# Altium project 4GLuxLogger.PrjPcb
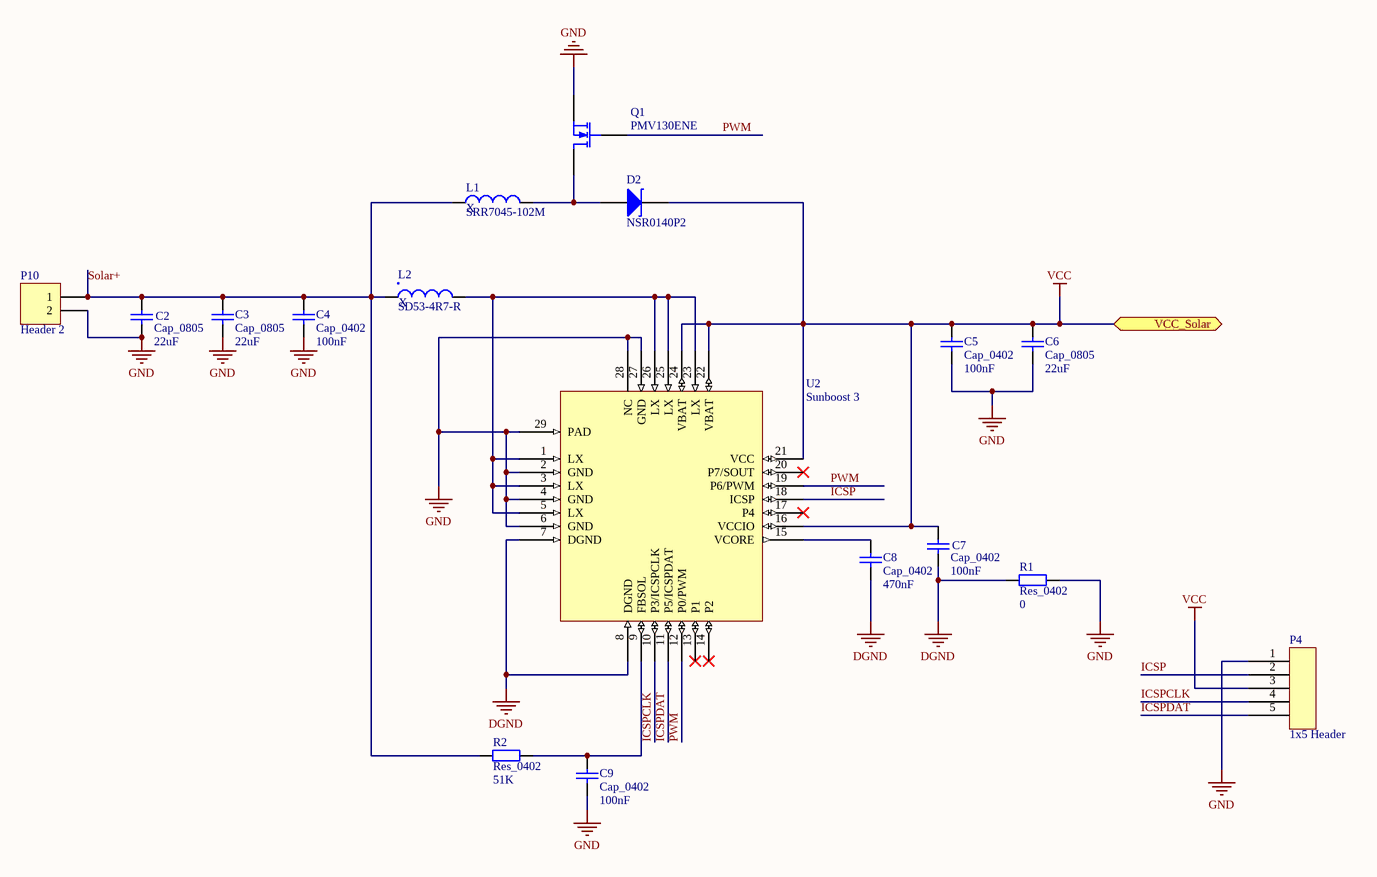
[diagram p0: SunBoost.SchDoc]
Project: 4GLX; Version: 1.0
4 sheets, 111 parts. Net scope: flat (ports and power ports of the same name join across sheets).
Board files: 6C-4L-1550um.PcbDoc, 4GLL_V2.PcbDoc
Sheets:
  SunBoost.SchDoc
  4G.SchDoc
  Power.SchDoc
  Mesh.SchDoc

## Sheet SunBoost.SchDoc
size A3; Organization: Altium Limited; Address1: L3, 12a Rodborough Rd; Address2: Frenchs Forest; Address3: NSW; Address4: Australia 2086

### Parts
C2  Cap_0805  value 22uF  [0805]
C3  Cap_0805  value 22uF  [0805]
C4  Cap_0402  value 100nF  [0402]
C5  Cap_0402  value 100nF  [0402]
C6  Cap_0805  value 22uF  [0805]
C7  Cap_0402  value 100nF  [0402]
C8  Cap_0402  value 470nF  [0402]
C9  Cap_0402  value 100nF  [0402]
D2  NSR0140P2  [SOD-923]
L1  SRR7045-102M  value X  [SRR7045-102M]
L2  SD53-4R7-R  value X  [SD53-4R7-R]
P4  1x5 Header  [1x5 Header 1.27]
P10  Header 2  [HDR1X2]
Q1  PMV130ENE  [SOT-23]
R1  Res_0402  value 0  [0402]
R2  Res_0402  value 51K  [0402]
U2  Sunboost 3  [28-QFN_0.4mm]

### Ports
VCC_Solar (bidir)

### Nets
DGND: C7.1 C8.1 R1.1 U2.7(DGND) U2.8(DGND)
GND: C2.1 C3.1 C4.1 C5.1 C6.1 C9.1 P4.1 P10.2 Q1.2(S) R1.2 U2.2(GND) U2.4(GND) U2.6(GND) U2.27(GND) U2.28(NC) U2.29(PAD)
VCC: C5.2 C6.2 C7.2 D2.1(K) P4.3 U2.16(VCCIO) U2.21(VCC) U2.22(VBAT) U2.24(VBAT) ; port VCC_Solar
ICSP: P4.2 U2.18(ICSP)
ICSPCLK: P4.4 U2.10(P3/ICSPCLK)
ICSPDAT: P4.5 U2.11(P5/ICSPDAT)
PWM: Q1.1(G) U2.12(P0/PWM) U2.19(P6/PWM)
Solar+: C2.2 C3.2 C4.2 L1.1 L2.1 P10.1 R2.1
NetC8_2: C8.2 U2.15(VCORE)
NetC9_2: C9.2 R2.2 U2.9(FBSOL)
NetD2_2: D2.2(A) L1.2 Q1.3(D)
NetL2_2: L2.2 U2.1(LX) U2.3(LX) U2.5(LX) U2.23(LX) U2.25(LX) U2.26(LX)

Not connected (* = marked no-connect by the designer): U2 13(P1)* 14(P2)* 17(P4)* 20(P7/SOUT)*

### Notes on the sheet
- Title
- Size:
- Date:
- A3
- Number:
- Time:
- Revision:
- Sheet
- of
- File:

### Library data of the parts
C2 C3 C6 = Cap_0805: Capacitor; Published: 8-Jun-2000; LatestRevisionDate: 17-Jul-2002; LatestRevisionNote: Re-released for DXP Platform.; PackageReference: RAD-0.3; Publisher: Altium Limited; PackageDescription: Radial Cap, Thru-Hole; 2 Leads; 0.3 in Pin Spacing
C4 C5 C7-C9 = Cap_0402: Capacitor; Published: 8-Jun-2000; LatestRevisionDate: 17-Jul-2002; LatestRevisionNote: Re-released for DXP Platform.; PackageReference: RAD-0.3; Publisher: Altium Limited; PackageDescription: Radial Cap, Thru-Hole; 2 Leads; 0.3 in Pin Spacing
D2 = NSR0140P2: Typical INFRARED GaAs LED; Published: 8-Jun-2000; LatestRevisionDate: 08-Jul-2005; LatestRevisionNote: Mech Layer 1 removed.; PackageReference: LED-0; Publisher: Altium Limited; PackageDescription: LED; 2 Leads
L1 = SRR7045-102M: Inductor
L2 = SD53-4R7-R: Inductor
P10 = Header 2: Header, 2-Pin; LatestRevisionDate: 17-Jul-2002; LatestRevisionNote: Re-released for DXP Platform.; Publisher: Altium Limited
Q1 = PMV130ENE: N-Channel MOSFET; Published: 8-Jun-2000; LatestRevisionDate: 17-Jul-2002; LatestRevisionNote: Re-released for DXP Platform.; PackageVersion: 1995/1996; PackageReference: E3; Publisher: Altium Limited; PackageDescription: TO, Flat Index; 3 In-Line, Axial Leads; Body Dia. 4.6mm; Lead Dia. 0.5 mm (max)
R1 R2 = Res_0402: Resistor; Published: 8-Jun-2000; LatestRevisionDate: 17-Jul-2002; LatestRevisionNote: Re-released for DXP Platform.; PackageReference: AXIAL-0.4; Publisher: Altium Limited; PackageDescription: Axial Device, Thru-Hole; 2 Leads; 0.4 in Pin Spacing
U2 = Sunboost 3: Initvation Sunboost 3

## Sheet 4G.SchDoc
size A3; Organization: Altium Limited; Address1: L3, 12a Rodborough Rd; Address2: Frenchs Forest; Address3: NSW; Address4: Australia 2086
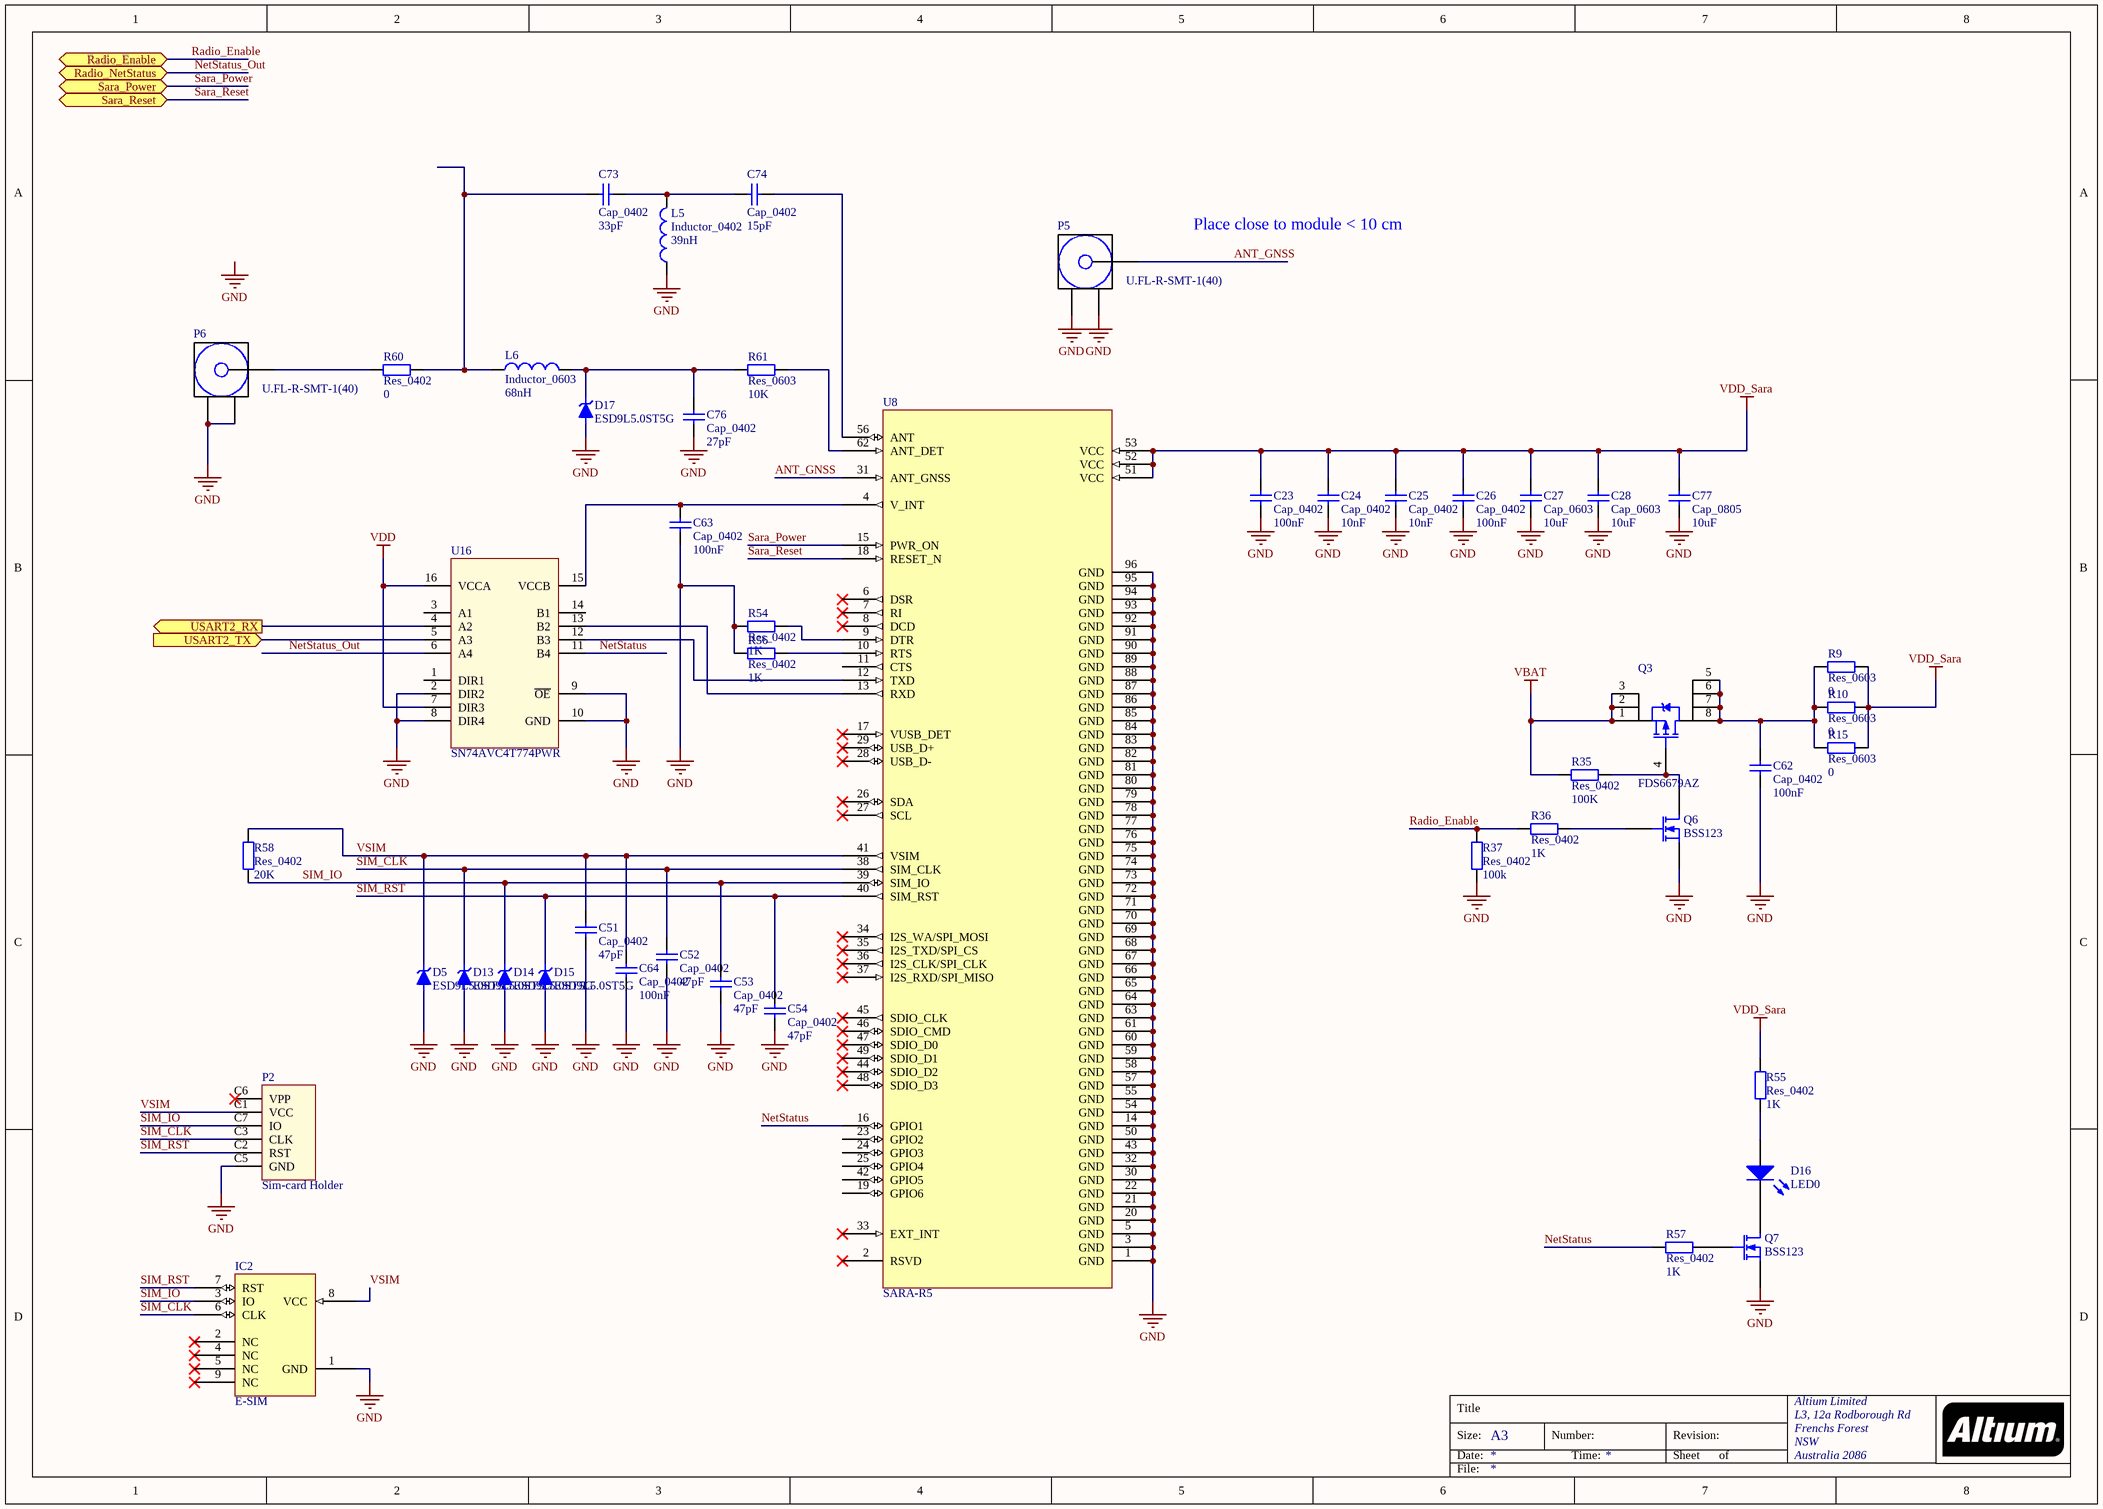
[diagram p1: 4G.SchDoc]

### Parts
C23  Cap_0402  value 100nF  [0402]
C24  Cap_0402  value 10nF  [0402]
C25  Cap_0402  value 10nF  [0402]
C26  Cap_0402  value 100nF  [0402]
C27  Cap_0603  value 10uF  [0603]
C28  Cap_0603  value 10uF  [0603]
C51  Cap_0402  value 47pF  [0402]
C52  Cap_0402  value 47pF  [0402]
C53  Cap_0402  value 47pF  [0402]
C54  Cap_0402  value 47pF  [0402]
C62  Cap_0402  value 100nF  [0402]
C63  Cap_0402  value 100nF  [0402]
C64  Cap_0402  value 100nF  [0402]
C73  Cap_0402  value 33pF  [0402]
C74  Cap_0402  value 15pF  [0402]
C76  Cap_0402  value 27pF  [0402]
C77  Cap_0805  value 10uF  [0805]
D5  ESD9L5.0ST5G  [SODFL100X40-2N]
D13  ESD9L5.0ST5G  [SODFL100X40-2N]
D14  ESD9L5.0ST5G  [SODFL100X40-2N]
D15  ESD9L5.0ST5G  [SODFL100X40-2N]
D16  LED0  [0603]
D17  ESD9L5.0ST5G  [SODFL100X40-2N]
IC2  E-SIM  [MFF2-ESIM]
L5  Inductor_0402  value 39nH  [0402]
L6  Inductor_0603  value 68nH  [0603]
P2  Sim-card Holder  [Sim-card Holder]
P5  U.FL-R-SMT-1(40)  [U.FL-R-SMT-1(40)]
P6  U.FL-R-SMT-1(40)  [U.FL-R-SMT-1(40)]
Q3  FDS6679AZ  [SOIC127P600X175-8N]
Q6  BSS123  [SOT-23]
Q7  BSS123  [SOT-23]
R9  Res_0603  value 0  [0603]
R10  Res_0603  value 0  [0603]
R15  Res_0603  value 0  [0603]
R35  Res_0402  value 100K  [0402]
R36  Res_0402  value 1K  [0402]
R37  Res_0402  value 100k  [0402]
R54  Res_0402  value 1K  [0402]
R55  Res_0402  value 1K  [0402]
R56  Res_0402  value 1K  [0402]
R57  Res_0402  value 1K  [0402]
R58  Res_0402  value 20K  [0402]
R60  Res_0402  value 0  [0402]
R61  Res_0603  value 10K  [0603]
U8  SARA-R5  [SARA-XX]
U16  SN74AVC4T774PWR  [TSOP65P640X120-16N]

### Ports
Radio_Enable (bidir), Radio_NetStatus (bidir), Sara_Power (bidir), Sara_Reset (bidir), USART2_RX (out), USART2_TX (in)

### Nets
GND: C23.1 C24.1 C25.1 C26.1 C27.1 C28.1 C51.1 C52.1 C53.1 C54.1 C62.1 C63.1 C64.1 C76.1 C77.1 D5.2 D13.2 D14.2 D15.2 D17.2 IC2.1(GND) L5.1 P2.C5(GND) P5.2 P5.3 P6.2 P6.3 Q6.2(S) Q7.2(S) R37.1 R54.1 R56.1 U8.1(GND) U8.3(GND) U8.5(GND) U8.14(GND) U8.20(GND) U8.21(GND) U8.22(GND) U8.30(GND) U8.32(GND) U8.43(GND) U8.50(GND) U8.54(GND) U8.55(GND) U8.57(GND) U8.58(GND) U8.59(GND) U8.60(GND) U8.61(GND) U8.63(GND) U8.64(GND) U8.65(GND) U8.66(GND) U8.67(GND) U8.68(GND) U8.69(GND) U8.70(GND) U8.71(GND) U8.72(GND) U8.73(GND) U8.74(GND) U8.75(GND) U8.76(GND) U8.77(GND) U8.78(GND) U8.79(GND) U8.80(GND) U8.81(GND) U8.82(GND) U8.83(GND) U8.84(GND) U8.85(GND) U8.86(GND) U8.87(GND) U8.88(GND) U8.89(GND) U8.90(GND) U8.91(GND) U8.92(GND) U8.93(GND) U8.94(GND) U8.95(GND) U8.96(GND) U16.2(DIR2) U16.8(DIR4) U16.9(~{OE}) U16.10(GND)
VBAT: Q3.1(S) Q3.2(S) Q3.3(S) R35.1
VDD: U16.7(DIR3) U16.16(VCCA)
VDD_Sara: C23.2 C24.2 C25.2 C26.2 C27.2 C28.2 C77.2 R9.2 R10.2 R15.2 R55.2 U8.51(VCC) U8.52(VCC) U8.53(VCC)
ANT_GNSS: P5.1 U8.31(ANT_GNSS)
NetStatus: R57.1 U8.16(GPIO1) U16.11(B4)
NetStatus_Out: U16.6(A4) ; port Radio_NetStatus
Radio_Enable: R36.1 R37.2 ; port Radio_Enable
Sara_Power: U8.15(PWR_ON) ; port Sara_Power
Sara_Reset: U8.18(RESET_N) ; port Sara_Reset
SIM_CLK: C52.2 D13.1 IC2.6(CLK) P2.C3(CLK) U8.38(SIM_CLK)
SIM_IO: C53.2 D14.1 IC2.3(IO) P2.C7(IO) R58.1 U8.39(SIM_IO)
SIM_RST: C54.2 D15.1 IC2.7(RST) P2.C2(RST) U8.40(SIM_RST)
VSIM: C51.2 C64.2 D5.1 IC2.8(VCC) P2.C1(VCC) R58.2 U8.41(VSIM)
NetC62_2: C62.2 Q3.5(D) Q3.6(D) Q3.7(D) Q3.8(D) R9.1 R10.1 R15.1
NetC63_2: C63.2 U8.4(V_INT) U16.15(VCCB)
NetC73_1: C73.1 C74.1 L5.2
NetC73_2: C73.2 L6.1 R60.2
NetC74_2: C74.2 U8.56(ANT)
NetC76_2: C76.2 D17.1 L6.2 R61.1
NetD16_1: D16.1(K) Q7.3(D)
NetD16_2: D16.2(A) R55.1
NetP6_1: P6.1 R60.1
NetQ3_4: Q3.4(G) Q6.3(D) R35.2
NetQ6_1: Q6.1(G) R36.2
NetQ7_1: Q7.1(G) R57.2
NetR54_2: R54.2 U8.9(DTR)
NetR56_2: R56.2 U8.10(RTS)
NetR61_2: R61.2 U8.62(ANT_DET)
NetU8_12: U8.12(TXD) U16.12(B3)
NetU8_13: U8.13(RXD) U16.13(B2)
NetU16_4: U16.4(A2) ; port USART2_RX
NetU16_5: U16.5(A3) ; port USART2_TX

Not connected (* = marked no-connect by the designer): IC2 2(NC)* 4(NC)* 5(NC)* 9(NC)*; P2 C6(VPP)*; U8 2(RSVD)* 6(DSR)* 7(RI)* 8(DCD)* 11(CTS) 17(VUSB_DET)* 19(GPIO6) 23(GPIO2) 24(GPIO3) 25(GPIO4) 26(SDA)* 27(SCL)* 28(USB_D-)* 29(USB_D+)* 33(EXT_INT)* 34(I2S_WA/SPI_MOSI)* 35(I2S_TXD/SPI_CS)* 36(I2S_CLK/SPI_CLK)* 37(I2S_RXD/SPI_MISO)* 42(GPIO5) 44(SDIO_D2)* 45(SDIO_CLK)* 46(SDIO_CMD)* 47(SDIO_D0)* 48(SDIO_D3)* 49(SDIO_D1)*; U16 1(DIR1) 3(A1) 14(B1)

### Notes on the sheet
- Place close to module < 10 cm
- Labels drawn without touching a wire or pin: GND
- Title
- Size:
- Date:
- A3
- Number:
- Time:
- Revision:
- Sheet
- of
- File:

### Library data of the parts
C23-C26 C51-C54 C62-C64 C73 C74 C76 = Cap_0402: Capacitor; Published: 8-Jun-2000; LatestRevisionDate: 17-Jul-2002; LatestRevisionNote: Re-released for DXP Platform.; PackageReference: RAD-0.3; Publisher: Altium Limited; PackageDescription: Radial Cap, Thru-Hole; 2 Leads; 0.3 in Pin Spacing
C27 C28 = Cap_0603: Capacitor; Published: 8-Jun-2000; LatestRevisionDate: 17-Jul-2002; LatestRevisionNote: Re-released for DXP Platform.; PackageReference: RAD-0.3; Publisher: Altium Limited; PackageDescription: Radial Cap, Thru-Hole; 2 Leads; 0.3 in Pin Spacing
C77 = Cap_0805: Capacitor; Published: 8-Jun-2000; LatestRevisionDate: 17-Jul-2002; LatestRevisionNote: Re-released for DXP Platform.; PackageReference: RAD-0.3; Publisher: Altium Limited; PackageDescription: Radial Cap, Thru-Hole; 2 Leads; 0.3 in Pin Spacing
D5 D13-D15 D17 = ESD9L5-0ST5G: TVS_ESD9L5-0ST5G
D16 = LED0: Typical INFRARED GaAs LED; Published: 8-Jun-2000; LatestRevisionDate: 08-Jul-2005; LatestRevisionNote: Mech Layer 1 removed.; PackageReference: LED-0; Publisher: Altium Limited; PackageDescription: LED; 2 Leads
L5 = Inductor_0402: Inductor
L6 = Inductor_0603: Inductor
P2 = Sim-card Holder: 788000001_Molex
P5 P6 = RF-Connector
Q3 = FDS6679AZ: Transistor, FET
Q6 Q7 = BSS123: N-Channel MOSFET; Published: 8-Jun-2000; LatestRevisionDate: 17-Jul-2002; LatestRevisionNote: Re-released for DXP Platform.; PackageVersion: 1995/1996; PackageReference: E3; Publisher: Altium Limited; PackageDescription: TO, Flat Index; 3 In-Line, Axial Leads; Body Dia. 4.6mm; Lead Dia. 0.5 mm (max)
R9 R10 R15 R61 = Res_0603: Resistor; Published: 8-Jun-2000; LatestRevisionDate: 17-Jul-2002; LatestRevisionNote: Re-released for DXP Platform.; PackageReference: AXIAL-0.4; Publisher: Altium Limited; PackageDescription: Axial Device, Thru-Hole; 2 Leads; 0.4 in Pin Spacing
R35-R37 R54-R58 R60 = Res_0402: Resistor; Published: 8-Jun-2000; LatestRevisionDate: 17-Jul-2002; LatestRevisionNote: Re-released for DXP Platform.; PackageReference: AXIAL-0.4; Publisher: Altium Limited; PackageDescription: Axial Device, Thru-Hole; 2 Leads; 0.4 in Pin Spacing
U16 = SN74AVC4T774PWR: Buffer

## Sheet Power.SchDoc
size A3; Organization: Altium Limited; Address1: L3, 12a Rodborough Rd; Address2: Frenchs Forest; Address3: NSW; Address4: Australia 2086
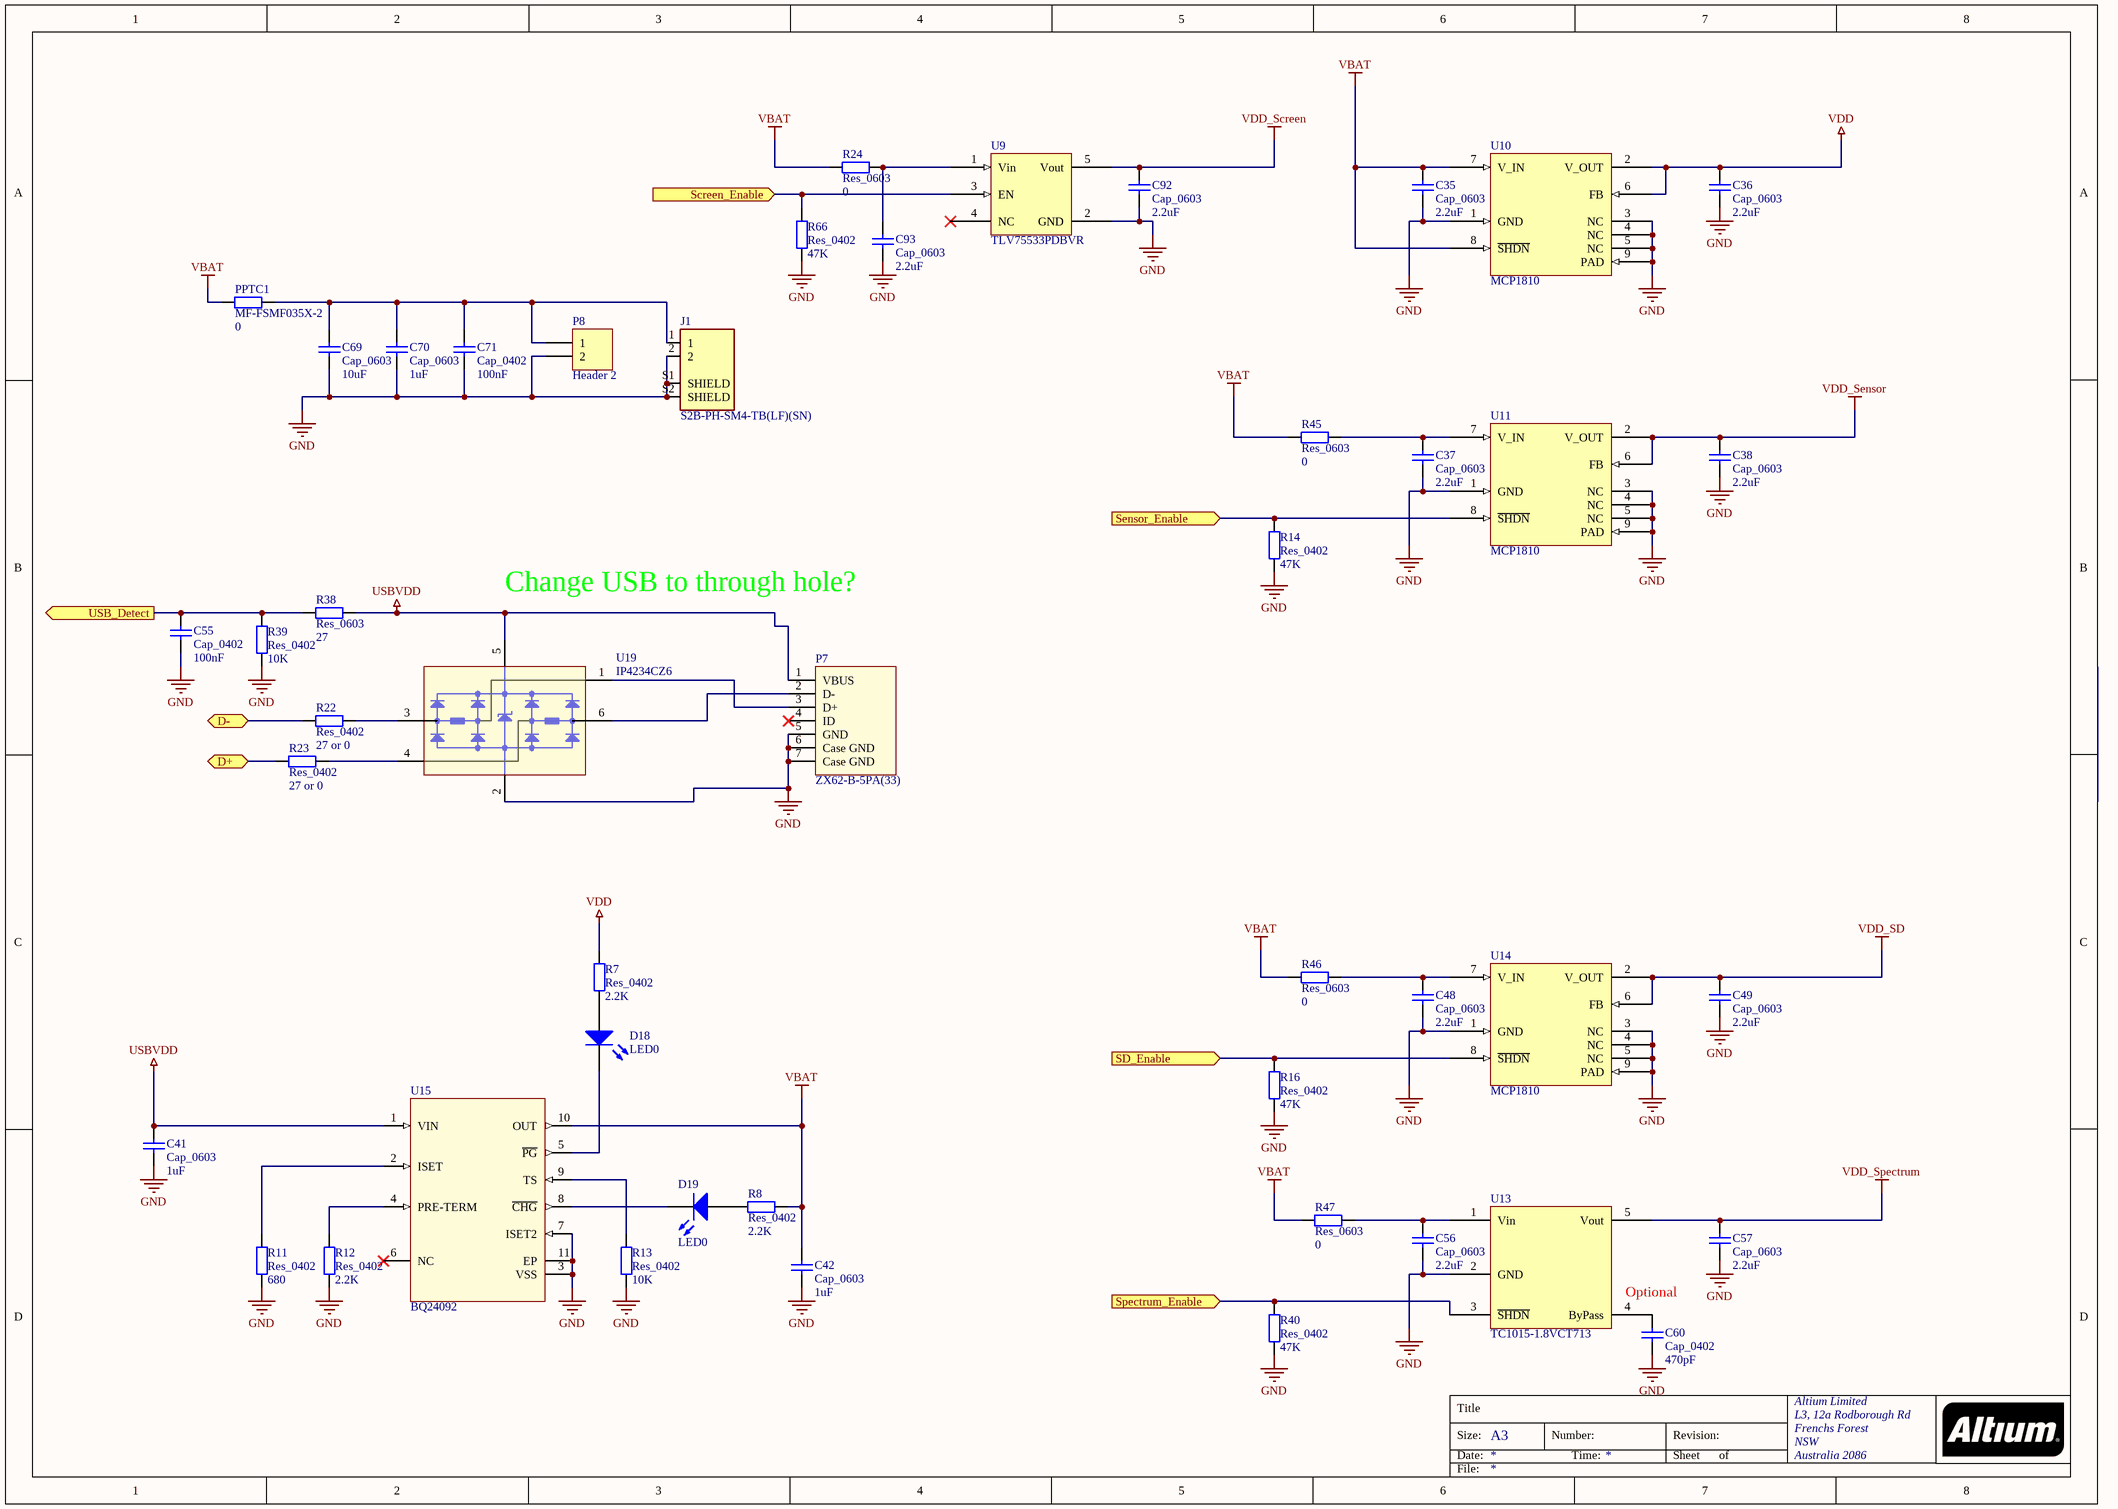
[diagram p2: Power.SchDoc]

### Parts
C35  Cap_0603  value 2.2uF  [0603]
C36  Cap_0603  value 2.2uF  [0603]
C37  Cap_0603  value 2.2uF  [0603]
C38  Cap_0603  value 2.2uF  [0603]
C41  Cap_0603  value 1uF  [0603]
C42  Cap_0603  value 1uF  [0603]
C48  Cap_0603  value 2.2uF  [0603]
C49  Cap_0603  value 2.2uF  [0603]
C55  Cap_0402  value 100nF  [0402]
C56  Cap_0603  value 2.2uF  [0603]
C57  Cap_0603  value 2.2uF  [0603]
C60  Cap_0402  value 470pF  [0402]
C69  Cap_0603  value 10uF  [0603]
C70  Cap_0603  value 1uF  [0603]
C71  Cap_0402  value 100nF  [0402]
C92  Cap_0603  value 2.2uF  [0603]
C93  Cap_0603  value 2.2uF  [0603]
D18  LED0  [0603]
D19  LED0  [0603]
J1  S2B-PH-SM4-TB(LF)(SN)  [JST_S2B-PH-SM4-TB(LF)(SN)]
P7  ZX62-B-5PA(33)  [ZX62-B-5PA(33)]
P8  Header 2  [HDR1X2]
PPTC1  MF-FSMF035X-2  value 0  [0603]
R7  Res_0402  value 2.2K  [0402]
R8  Res_0402  value 2.2K  [0402]
R11  Res_0402  value 680  [0402]
R12  Res_0402  value 2.2K  [0402]
R13  Res_0402  value 10K  [0402]
R14  Res_0402  value 47K  [0402]
R16  Res_0402  value 47K  [0402]
R22  Res_0402  value 27 or 0  [0402]
R23  Res_0402  value 27 or 0  [0402]
R24  Res_0603  value 0  [0603]
R38  Res_0603  value 27  [0603]
R39  Res_0402  value 10K  [0402]
R40  Res_0402  value 47K  [0402]
R45  Res_0603  value 0  [0603]
R46  Res_0603  value 0  [0603]
R47  Res_0603  value 0  [0603]
R66  Res_0402  value 47K  [0402]
U9  TLV75533PDBVR  [SOT-23 (5)]
U10  MCP1810  [VDFN8]
U11  MCP1810  [VDFN8]
U13  TC1015-1.8VCT713  [SOT-23 (5)]
U14  MCP1810  [VDFN8]
U15  BQ24092  [HVSSOP-10]
U19  IP4234CZ6  [TSOP95P280X110_HS-7N]

### Ports
D+ (bidir), D- (bidir), Screen_Enable (in), SD_Enable (in), Sensor_Enable (in), Spectrum_Enable (in), USB_Detect (out)

### Nets
GND: C35.1 C36.1 C37.1 C38.1 C41.1 C42.1 C48.1 C49.1 C55.1 C56.1 C57.1 C60.1 C69.1 C70.1 C71.1 C92.1 C93.1 J1.2 J1.S1(SHIELD) J1.S2(SHIELD) P7.5(GND) P7.6(Case_GND) P7.7(Case_GND) P8.2 R11.1 R12.1 R13.1 R14.2 R16.1 R39.1 R40.2 R66.2 U9.2(GND) U10.1(GND) U10.3(NC) U10.4(NC) U10.5(NC) U10.9(PAD) U11.1(GND) U11.3(NC) U11.4(NC) U11.5(NC) U11.9(PAD) U13.2(GND) U14.1(GND) U14.3(NC) U14.4(NC) U14.5(NC) U14.9(PAD) U15.3(VSS) U15.7(ISET2) U15.11(EP) U19.2(GND)
USBVDD: C41.2 P7.1(VBUS) R38.2 U15.1(VIN) U19.5(VCC)
VBAT: C35.2 C42.2 PPTC1.1 R8.1 R24.1 R45.1 R46.1 R47.1 U10.7(V_IN) U10.8(~{SHDN}) U15.10(OUT)
VDD: C36.2 R7.2 U10.2(V_OUT) U10.6(FB)
VDD_Screen: C92.2 U9.5(Vout)
VDD_SD: C49.2 U14.2(V_OUT) U14.6(FB)
VDD_Sensor: C38.2 U11.2(V_OUT) U11.6(FB)
VDD_Spectrum: C57.2 U13.5(Vout)
NetC37_2: C37.2 R45.2 U11.7(V_IN)
NetC48_2: C48.2 R46.2 U14.7(V_IN)
NetC55_2: C55.2 R38.1 R39.2 ; port USB_Detect
NetC56_2: C56.2 R47.2 U13.1(Vin)
NetC60_2: C60.2 U13.4(ByPass)
NetC69_2: C69.2 C70.2 C71.2 J1.1 P8.1 PPTC1.2
NetC93_2: C93.2 R24.2 U9.1(Vin)
NetD18_1: D18.1(K) U15.5(~{PG})
NetD18_2: D18.2(A) R7.1
NetD19_1: D19.1(K) U15.8(~{CHG})
NetD19_2: D19.2(A) R8.2
NetP7_2: P7.2(D-) U19.6(CH2_B)
NetP7_3: P7.3(D+) U19.1(CH1_A)
NetR11_2: R11.2 U15.2(ISET)
NetR12_2: R12.2 U15.4(PRE-TERM)
NetR13_2: R13.2 U15.9(TS)
NetR14_1: R14.1 U11.8(~{SHDN}) ; port Sensor_Enable
NetR16_2: R16.2 U14.8(~{SHDN}) ; port SD_Enable
NetR22_1: R22.1 ; port D-
NetR22_2: R22.2 U19.3(CH1_B)
NetR23_1: R23.1 ; port D+
NetR23_2: R23.2 U19.4(CH2_A)
NetR40_1: R40.1 U13.3(~{SHDN}) ; port Spectrum_Enable
NetR66_1: R66.1 U9.3(EN) ; port Screen_Enable

Not connected (* = marked no-connect by the designer): P7 4(ID)*; U9 4(NC)*; U15 6(NC)*

### Notes on the sheet
- Change USB to through hole?
- (near U13) Optional
- Title
- Size:
- Date:
- A3
- Number:
- Time:
- Revision:
- Sheet
- of
- File:

### Library data of the parts
C35-C38 C41 C42 C48 C49 C56 C57 C69 C70 C92 C93 = Cap_0603: Capacitor; Published: 8-Jun-2000; LatestRevisionDate: 17-Jul-2002; LatestRevisionNote: Re-released for DXP Platform.; PackageReference: RAD-0.3; Publisher: Altium Limited; PackageDescription: Radial Cap, Thru-Hole; 2 Leads; 0.3 in Pin Spacing
C55 C60 C71 = Cap_0402: Capacitor; Published: 8-Jun-2000; LatestRevisionDate: 17-Jul-2002; LatestRevisionNote: Re-released for DXP Platform.; PackageReference: RAD-0.3; Publisher: Altium Limited; PackageDescription: Radial Cap, Thru-Hole; 2 Leads; 0.3 in Pin Spacing
D18 D19 = LED0: Typical INFRARED GaAs LED; Published: 8-Jun-2000; LatestRevisionDate: 08-Jul-2005; LatestRevisionNote: Mech Layer 1 removed.; PackageReference: LED-0; Publisher: Altium Limited; PackageDescription: LED; 2 Leads
J1 = S2B-PH-SM4-TB(LF)(SN): PH Series 2 Position 2 mm Pitch Surface Mount Side Entry Shrouded Header; MF: {'manufacturer': u'JST Sales'}; MP: S2B-PH-SM4-TB(LF)(SN); Availability: Unavailable; Package: None; Price: None; Value: *
P7 = ZX62-B-5PA(33): USB Connector
P8 = Header 2: Header, 2-Pin; LatestRevisionDate: 17-Jul-2002; LatestRevisionNote: Re-released for DXP Platform.; Publisher: Altium Limited
PPTC1 = MF-FSMF035X-2: PPTC_0603; Published: 8-Jun-2000; LatestRevisionDate: 17-Jul-2002; LatestRevisionNote: Re-released for DXP Platform.; PackageReference: AXIAL-0.4; Publisher: Altium Limited; PackageDescription: Axial Device, Thru-Hole; 2 Leads; 0.4 in Pin Spacing
R7 R8 R11-R14 R16 R22 R23 R39 R40 R66 = Res_0402: Resistor; Published: 8-Jun-2000; LatestRevisionDate: 17-Jul-2002; LatestRevisionNote: Re-released for DXP Platform.; PackageReference: AXIAL-0.4; Publisher: Altium Limited; PackageDescription: Axial Device, Thru-Hole; 2 Leads; 0.4 in Pin Spacing
R24 R38 R45-R47 = Res_0603: Resistor; Published: 8-Jun-2000; LatestRevisionDate: 17-Jul-2002; LatestRevisionNote: Re-released for DXP Platform.; PackageReference: AXIAL-0.4; Publisher: Altium Limited; PackageDescription: Axial Device, Thru-Hole; 2 Leads; 0.4 in Pin Spacing
U9 = TLV75533PDBVR: 3.3V regulator
U10 U11 U14 = MCP1810: 3V Regulator, 150 mA
U13 = TC1015-1.8VCT713: 1.8V Regulator
U15 = BQ24092: Battery Charger
U19 = IP4234CZ6: USB Line Protection

## Sheet Mesh.SchDoc
size A3; Organization: Altium Limited; Address1: L3, 12a Rodborough Rd; Address2: Frenchs Forest; Address3: NSW; Address4: Australia 2086
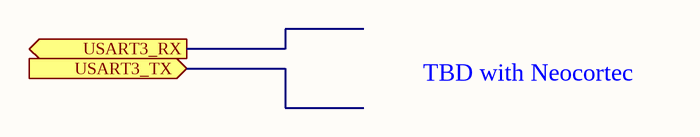
[diagram p3: Mesh.SchDoc]

### Ports
USART3_RX (out), USART3_TX (in)

### Notes on the sheet
- TBD with Neocortec
- Title
- Size:
- Date:
- A3
- Number:
- Time:
- Revision:
- Sheet
- of
- File:

## Nets that join several sheets
GND: SunBoost (16 pins), 4G (88 pins), Power (53 pins)
VBAT: 4G (Q3.1 Q3.2 Q3.3 R35.1), Power (11 pins)
VDD: 4G (U16.7 U16.16), Power (C36.2 R7.2 U10.2 U10.6)